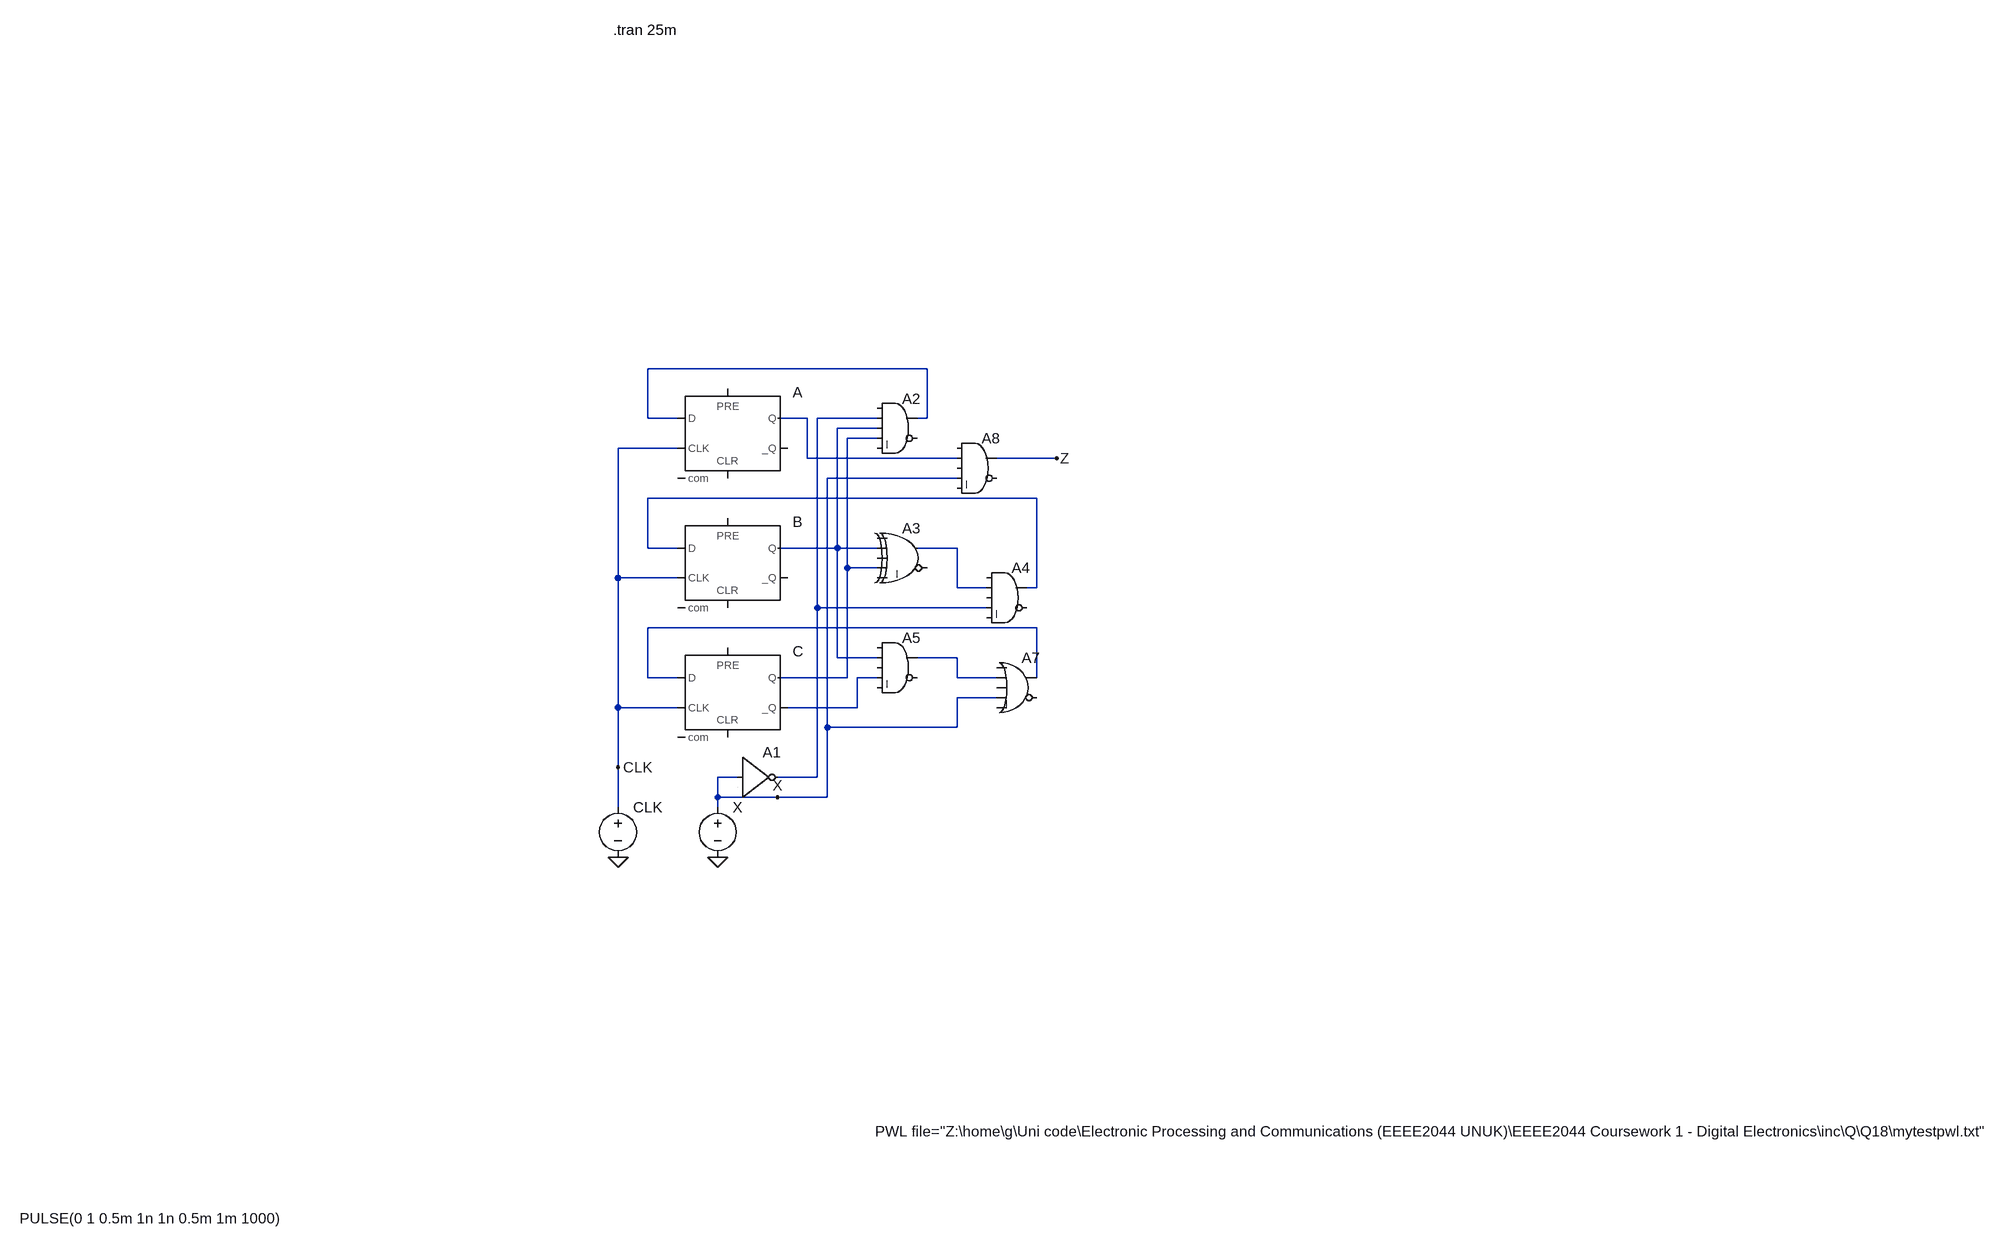
[diagram p0: schematic Q19.asc]
Q19.asc, the LTspice schematic file:
Version 4
SHEET 1 2440 1380
WIRE 576 0 128 0
WIRE 128 80 128 0
WIRE 176 80 128 80
WIRE 384 80 336 80
WIRE 496 80 400 80
WIRE 576 80 576 0
WIRE 576 80 560 80
WIRE 496 96 432 96
WIRE 496 112 448 112
WIRE 176 128 80 128
WIRE 384 144 384 80
WIRE 624 144 384 144
WIRE 784 144 688 144
WIRE 624 176 416 176
WIRE 752 208 128 208
WIRE 128 288 128 208
WIRE 176 288 128 288
WIRE 432 288 432 96
WIRE 432 288 336 288
WIRE 496 288 432 288
WIRE 624 288 560 288
WIRE 448 320 448 112
WIRE 496 320 448 320
WIRE 80 336 80 128
WIRE 176 336 80 336
WIRE 624 352 624 288
WIRE 672 352 624 352
WIRE 752 352 752 208
WIRE 752 352 736 352
WIRE 400 384 400 80
WIRE 672 384 400 384
WIRE 752 416 128 416
WIRE 432 464 432 288
WIRE 496 464 432 464
WIRE 624 464 560 464
WIRE 128 496 128 416
WIRE 176 496 128 496
WIRE 448 496 448 320
WIRE 448 496 336 496
WIRE 496 496 464 496
WIRE 624 496 624 464
WIRE 688 496 624 496
WIRE 752 496 752 416
WIRE 688 528 624 528
WIRE 80 544 80 336
WIRE 176 544 80 544
WIRE 464 544 464 496
WIRE 464 544 352 544
WIRE 416 576 416 176
WIRE 624 576 624 528
WIRE 624 576 416 576
WIRE 80 640 80 544
WIRE 272 656 240 656
WIRE 400 656 400 384
WIRE 400 656 336 656
WIRE 240 688 240 656
WIRE 336 688 240 688
WIRE 416 688 416 576
WIRE 416 688 336 688
WIRE 80 704 80 640
WIRE 240 704 240 688
FLAG 80 784 0
FLAG 240 784 0
FLAG 784 144 Z
FLAG 336 688 X
FLAG 80 640 CLK
SYMBOL Digital\\dflop 256 32 R0
SYMATTR InstName A
SYMATTR SpiceLine Td=40n
SYMBOL Digital\\dflop 256 240 R0
SYMATTR InstName B
SYMATTR SpiceLine Td=40n
SYMBOL Digital\\dflop 256 448 R0
SYMATTR InstName C
SYMATTR SpiceLine Td=40n
SYMBOL voltage 80 688 R0
WINDOW 3 -960 676 Left 2
WINDOW 123 0 0 Left 0
WINDOW 39 0 0 Left 0
SYMATTR InstName CLK
SYMATTR Value PULSE(0 1 0.5m 1n 1n 0.5m 1m 1000)
SYMBOL voltage 240 688 R0
WINDOW 3 253 536 Left 2
WINDOW 123 0 0 Left 0
WINDOW 39 0 0 Left 0
SYMATTR InstName X
SYMATTR Value PWL file="Z:\home\g\Uni code\Electronic Processing and Communications (EEEE2044 UNUK)\EEEE2044 Coursework 1 - Digital Electronics\inc\Q\Q18\mytestpwl.txt"
SYMBOL Digital\\and 528 32 R0
SYMATTR InstName A2
SYMATTR SpiceLine Td=27n
SYMBOL Digital\\xor 544 240 R0
SYMATTR InstName A3
SYMATTR SpiceLine Td=22n
SYMBOL Digital\\and 704 304 R0
SYMATTR InstName A4
SYMATTR SpiceLine Td=40n
SYMBOL Digital\\and 528 416 R0
SYMATTR InstName A5
SYMATTR SpiceLine Td=27n
SYMBOL Digital\\or 720 448 R0
SYMATTR InstName A7
SYMATTR SpiceLine Td=22n
SYMBOL Digital\\and 656 96 R0
SYMATTR InstName A8
SYMATTR SpiceLine Td=22n
SYMBOL Digital\\inv 272 592 R0
SYMATTR InstName A1
SYMATTR SpiceLine Td=20n
TEXT 72 -544 Left 2 !.tran 25m

The netlist it stands for:
* Q19.asc
A N001 0 CLK 0 0 0 N002 0 DFLOP Td=40n
A§B N006 0 CLK 0 0 0 N004 0 DFLOP Td=40n
A§C N008 0 CLK 0 0 N010 N005 0 DFLOP Td=40n
V§CLK CLK 0 PULSE(0 1 0.5m 1n 1n 0.5m 1m 1000)
V§X X 0 PWL file="Z:\home\g\Uni code\Electronic Processing and Communications (EEEE2044 UNUK)\EEEE2044 Coursework 1 - Digital Electronics\inc\Q\Q18\mytestpwl.txt"
A2 0 N003 N004 N005 0 0 N001 0 AND Td=27n
A3 0 N004 0 N005 0 0 N007 0 XOR Td=22n
A4 0 N007 0 N003 0 0 N006 0 AND Td=40n
A5 0 N004 0 N010 0 0 N009 0 AND Td=27n
A7 0 N009 0 X 0 0 N008 0 OR Td=22n
A8 0 N002 0 X 0 0 Z 0 AND Td=22n
A1 X 0 0 0 0 N003 0 0 BUF Td=20n
.tran 25m
.backanno
.end